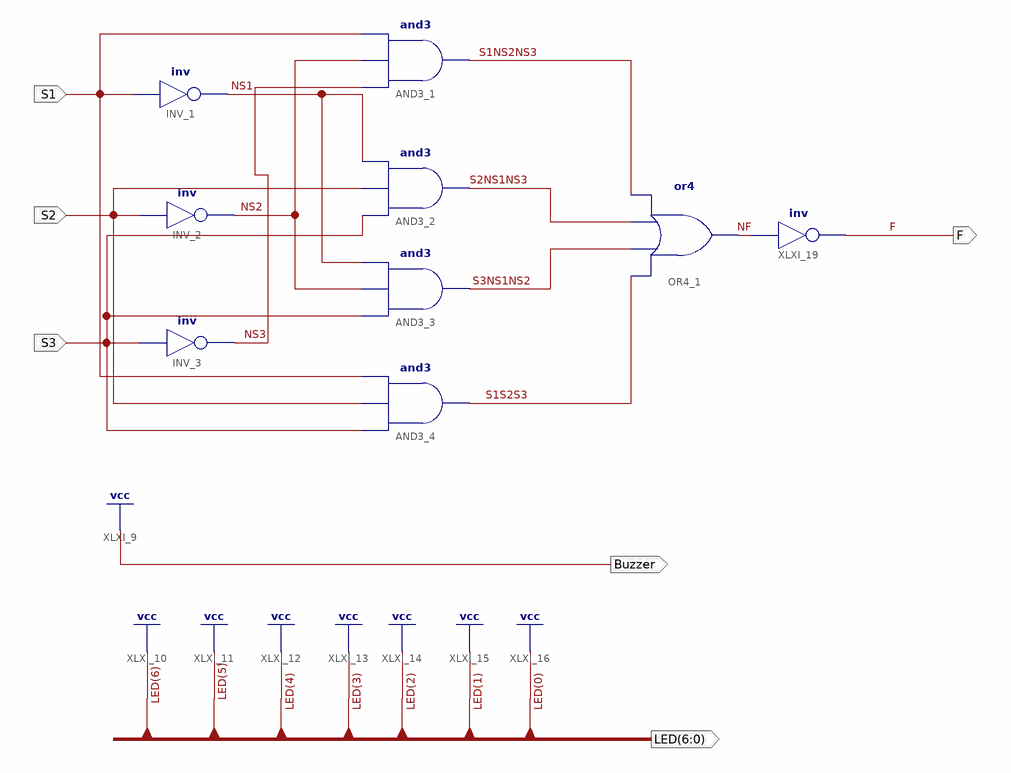
[diagram p0: schematic sheet 1]
// Xilinx ISE schematic lamp_zxd.sch (kintex7) as structural Verilog: 9 symbols, 6 ports
module lamp_zxd (
  input  S1,
  input  S2,
  input  S3,
  output Buzzer,
  output [6:0] LED,
  output F
);

  wire NF, NS1, NS2, NS3, S1NS2NS3, S1S2S3, S2NS1NS3, S3NS1NS2;

  not INV_1 (NS1, S1);
  not INV_2 (NS2, S2);
  not INV_3 (NS3, S3);
  and AND3_1 (S1NS2NS3, NS3, NS2, S1);
  and AND3_2 (S2NS1NS3, S3, S2, NS1);
  and AND3_3 (S3NS1NS2, S3, NS2, NS1);
  and AND3_4 (S1S2S3, S3, S2, S1);
  or OR4_1 (NF, S1S2S3, S3NS1NS2, S2NS1NS3, S1NS2NS3);
  not XLXI_19 (F, NF);

  assign Buzzer = 1'b1;
  assign LED = {7{1'b1}};
endmodule
